# Altium schematic sheet [2] - Power_Budget.SchDoc
size A; SheetNumber: 2; SheetTotal: 2
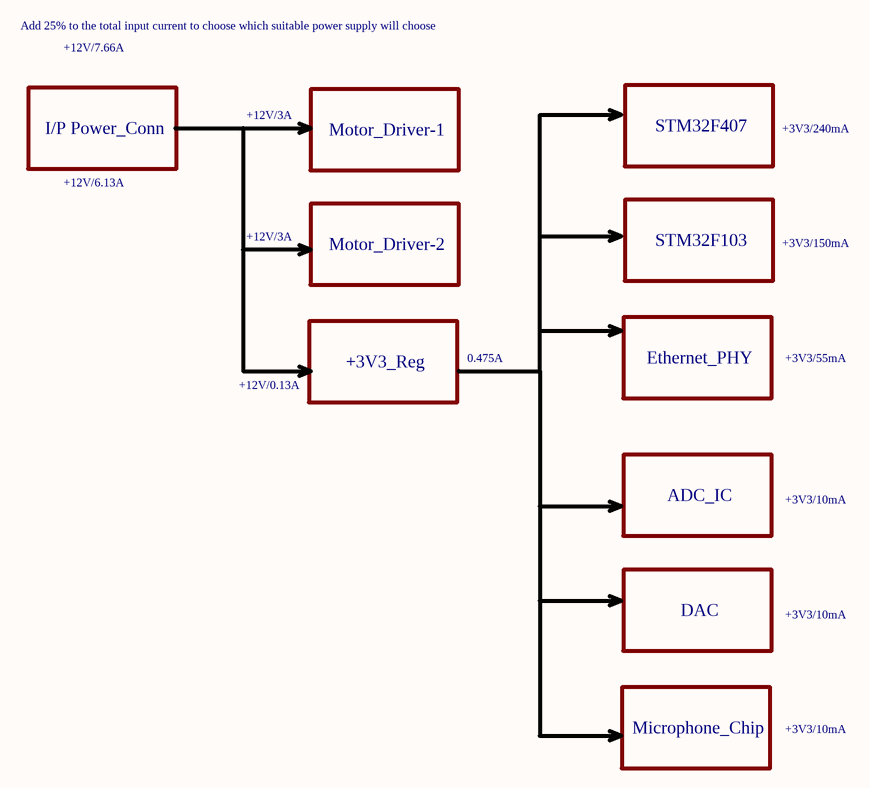
[diagram p0: [2] - Power_Budget.SchDoc]

## Notes on the sheet
- Add 25% to the total input current to choose which suitable power supply will choose
- +12V/7.66A
- +12V/3A
- +12V/6.13A
- I/P Power_Conn
- Motor_Driver-1
- STM32F407
- +3V3/240mA
- Motor_Driver-2
- STM32F103
- +3V3/150mA
- +12V/0.13A
- +3V3_Reg
- 0.475A
- Ethernet_PHY
- +3V3/55mA
- ADC_IC
- +3V3/10mA
- DAC
- Microphone_Chip